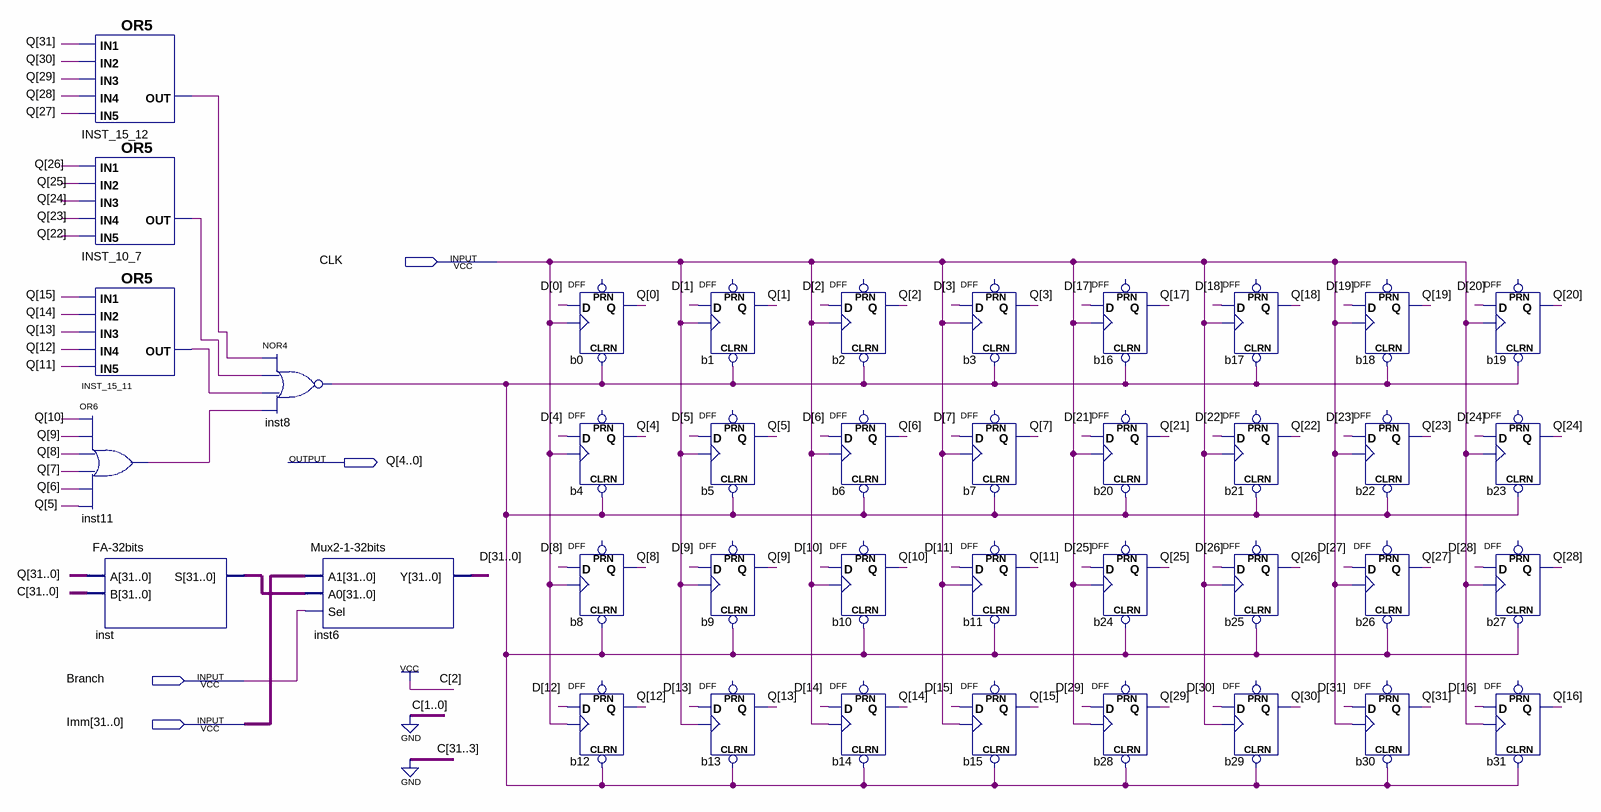
[diagram p0: schematic sheet]
// Quartus schematic PC.bdf as structural Verilog: 39 symbols, 4 pins
module PC (
  input  CLK,
  input  Branch,
  input  [31:0] Imm,
  output [31:0] Q
);

  wire inst8_out, inst11_out, INST_10_7_out, INST_15_11_out, INST_15_12_out;
  wire [31:0] D, inst_s;

  or INST_15_12 (INST_15_12_out, Q[31], Q[30], Q[29], Q[28], Q[27]);
  or INST_10_7 (INST_10_7_out, Q[26], Q[25], Q[24], Q[23], Q[22]);
  or INST_15_11 (INST_15_11_out, Q[15], Q[14], Q[13], Q[12], Q[11]);
  or inst11 (inst11_out, Q[10], Q[9], Q[8], Q[7], Q[6], Q[5]);
  \FA-32bits  inst (.A(Q), .B(32'b00000000000000000000000000000100), .S(inst_s));
  nor inst8 (inst8_out, INST_15_12_out, INST_10_7_out, INST_15_11_out, inst11_out);
  \Mux2-1-32bits  inst6 (.A1(Imm), .A0(inst_s), .Sel(Branch), .Y(D));
  DFF b0 (.CLRN(inst8_out), .CLK(CLK), .D(D[0]), .Q(Q[0]));  // open: PRN
  DFF b4 (.CLRN(inst8_out), .CLK(CLK), .D(D[4]), .Q(Q[4]));  // open: PRN
  DFF b8 (.CLRN(inst8_out), .CLK(CLK), .D(D[8]), .Q(Q[8]));  // open: PRN
  DFF b12 (.CLRN(inst8_out), .CLK(CLK), .D(D[12]), .Q(Q[12]));  // open: PRN
  DFF b1 (.CLRN(inst8_out), .CLK(CLK), .D(D[1]), .Q(Q[1]));  // open: PRN
  DFF b5 (.CLRN(inst8_out), .CLK(CLK), .D(D[5]), .Q(Q[5]));  // open: PRN
  DFF b9 (.CLRN(inst8_out), .CLK(CLK), .D(D[9]), .Q(Q[9]));  // open: PRN
  DFF b13 (.CLRN(inst8_out), .CLK(CLK), .D(D[13]), .Q(Q[13]));  // open: PRN
  DFF b2 (.CLRN(inst8_out), .CLK(CLK), .D(D[2]), .Q(Q[2]));  // open: PRN
  DFF b6 (.CLRN(inst8_out), .CLK(CLK), .D(D[6]), .Q(Q[6]));  // open: PRN
  DFF b10 (.CLRN(inst8_out), .CLK(CLK), .D(D[10]), .Q(Q[10]));  // open: PRN
  DFF b14 (.CLRN(inst8_out), .CLK(CLK), .D(D[14]), .Q(Q[14]));  // open: PRN
  DFF b3 (.CLRN(inst8_out), .CLK(CLK), .D(D[3]), .Q(Q[3]));  // open: PRN
  DFF b7 (.CLRN(inst8_out), .CLK(CLK), .D(D[7]), .Q(Q[7]));  // open: PRN
  DFF b11 (.CLRN(inst8_out), .CLK(CLK), .D(D[11]), .Q(Q[11]));  // open: PRN
  DFF b15 (.CLRN(inst8_out), .CLK(CLK), .D(D[15]), .Q(Q[15]));  // open: PRN
  DFF b16 (.CLRN(inst8_out), .CLK(CLK), .D(D[17]), .Q(Q[17]));  // open: PRN
  DFF b20 (.CLRN(inst8_out), .CLK(CLK), .D(D[21]), .Q(Q[21]));  // open: PRN
  DFF b24 (.CLRN(inst8_out), .CLK(CLK), .D(D[25]), .Q(Q[25]));  // open: PRN
  DFF b28 (.CLRN(inst8_out), .CLK(CLK), .D(D[29]), .Q(Q[29]));  // open: PRN
  DFF b17 (.CLRN(inst8_out), .CLK(CLK), .D(D[18]), .Q(Q[18]));  // open: PRN
  DFF b21 (.CLRN(inst8_out), .CLK(CLK), .D(D[22]), .Q(Q[22]));  // open: PRN
  DFF b25 (.CLRN(inst8_out), .CLK(CLK), .D(D[26]), .Q(Q[26]));  // open: PRN
  DFF b29 (.CLRN(inst8_out), .CLK(CLK), .D(D[30]), .Q(Q[30]));  // open: PRN
  DFF b18 (.CLRN(inst8_out), .CLK(CLK), .D(D[19]), .Q(Q[19]));  // open: PRN
  DFF b22 (.CLRN(inst8_out), .CLK(CLK), .D(D[23]), .Q(Q[23]));  // open: PRN
  DFF b26 (.CLRN(inst8_out), .CLK(CLK), .D(D[27]), .Q(Q[27]));  // open: PRN
  DFF b30 (.CLRN(inst8_out), .CLK(CLK), .D(D[31]), .Q(Q[31]));  // open: PRN
  DFF b19 (.CLRN(inst8_out), .CLK(CLK), .D(D[20]), .Q(Q[20]));  // open: PRN
  DFF b23 (.CLRN(inst8_out), .CLK(CLK), .D(D[24]), .Q(Q[24]));  // open: PRN
  DFF b27 (.CLRN(inst8_out), .CLK(CLK), .D(D[28]), .Q(Q[28]));  // open: PRN
  DFF b31 (.CLRN(inst8_out), .CLK(CLK), .D(D[16]), .Q(Q[16]));  // open: PRN
endmodule
